# Altium project 2_SLOT_PCB.PrjPcb
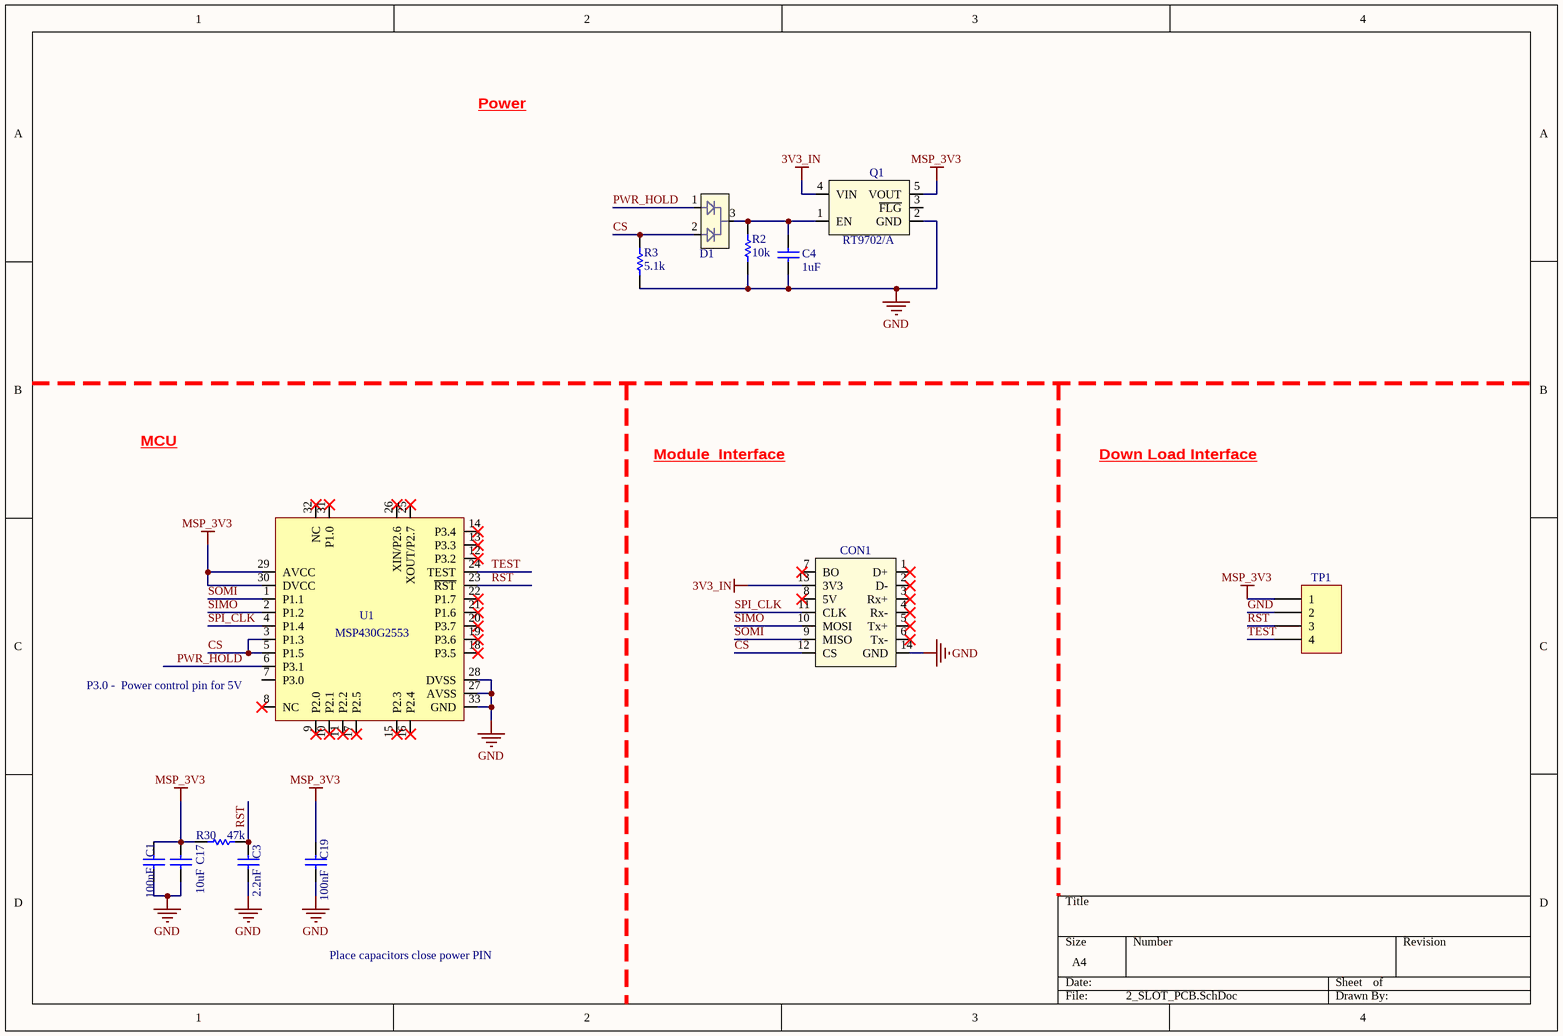
[diagram p0: 2_SLOT_PCB.SchDoc]
1 sheet, 13 parts. Net scope: global (net labels, ports and power ports of the same name join across sheets).
Board file: 2_SLOT_PCB.PcbDoc

## Sheet 2_SLOT_PCB.SchDoc: MSP_PCB_Template
size A4

### Parts
C1  value 100nF  [0402]  (hidden comment: Cap)
C3  value 2.2nF  [0402]  (hidden comment: Cap)
C4  value 1uF  [0402]  (hidden comment: Cap)
C17  value 10uF  [0603]  (hidden comment: Cap)
C19  value 100nF  [0402]  (hidden comment: Cap)
CON1  (no value)  [edge-connector-0.8*1.0]
D1  Dual Diode (common cath)  [SOT-523]  (value not drawn)
Q1  RT9702/A  [SOT-23-5]
R2  value 10k  [0402]  (hidden comment: Res1)
R3  value 5.1k  [0402]  (hidden comment: Res1)
R30  value 47k  [0402]  (hidden comment: Res1)
TP1  (no value)  [header 4x1 30*30-55mil]
U1  MSP430G2553  [QFN-32-5x5]

### Nets
3V3_IN: CON1.13(3V3) Q1.4(VIN)
GND: C1.1 C3.1 C4.1 C17.1 C19.1 CON1.14(GND) Q1.2(GND) R2.2 R3.2 TP1.2 U1.27(AVSS) U1.28(DVSS) U1.33(GND)
MSP_3V3: C1.2 C17.2 C19.2 Q1.5(VOUT) R30.2 TP1.1 U1.29(AVCC) U1.30(DVCC)
CS: CON1.12(CS) D1.2 R3.1 U1.3(P1.3) U1.5(P1.5)
PWR_HOLD: D1.1 U1.6(P3.1)
RST: C3.2 R30.1 TP1.3 U1.23(~{RST})
SIMO: CON1.10(MOSI) U1.2(P1.2)
SOMI: CON1.9(MISO) U1.1(P1.1)
SPI_CLK: CON1.11(CLK) U1.4(P1.4)
TEST: TP1.4 U1.24(TEST)
NetC4_2: C4.2 D1.3 Q1.1(EN) R2.1

Not connected (* = marked no-connect by the designer): CON1 1(D+)* 2(D-)* 3(Rx+)* 4(Rx-)* 5(Tx+)* 6(Tx-)* 7(BO)* 8(5V)*; Q1 3(~{FLG}); U1 7(P3.0) 8(NC)* 9(P2.0)* 10(P2.1)* 11(P2.2)* 12(P3.2)* 13(P3.3)* 14(P3.4)* 15(P2.3)* 16(P2.4)* 17(P2.5)* 18(P3.5)* 19(P3.6)* 20(P3.7)* 21(P1.6)* 22(P1.7)* 25(XOUT/P2.7)* 26(XIN/P2.6)* 31(P1.0)* 32(NC)*

### Notes on the sheet
- Power
- MCU
- Module  Interface
- Down Load Interface
- (near U1) P3.0 -  Power control pin for 5V
- Place capacitors close power PIN

### Library data of the parts
C1 C3 C4 C17 C19 = Cap: Capacitor; Published: 8-Jun-2000; LatestRevisionDate: 17-Jul-2002; LatestRevisionNote: Re-released for DXP Platform.; PackageReference: RAD-0.3; Publisher: Altium Limited; PackageDescription: Radial Cap, Thru-Hole; 2 Leads; 0.3 in Pin Spacing
CON1 = NP_EdgeConnector-2*7: Module interface
D1 = Dual Diode (common cath): BAS40-05T; Manufacturer: DIODES; Part number: BAS40-05T-7-F
Q1 = RT9702/A: RICHTEK RT9702/A; Part number: RT9702/A GB; Manufacturer: RICHTEK
R2 R3 R30 = Res1: Resistor; Published: 8-Jun-2000; LatestRevisionDate: 17-Jul-2002; LatestRevisionNote: Re-released for DXP Platform.; PackageReference: AXIAL-0.3; Publisher: Altium Limited; PackageDescription: Axial Device, Thru-Hole; 2 Leads; 0.3 in Pin Spacing
TP1 = Header 4: Down Load Interface; LatestRevisionDate: 17-Jul-2002; LatestRevisionNote: Re-released for DXP Platform.; Publisher: Altium Limited
U1 = MSP430G2553: pin to pad: 33>0; Manufacturer: TI; Part number: MSP430G2353IRHB32R